# EAGLE design guider-shield (EAGLE 7.6.0)
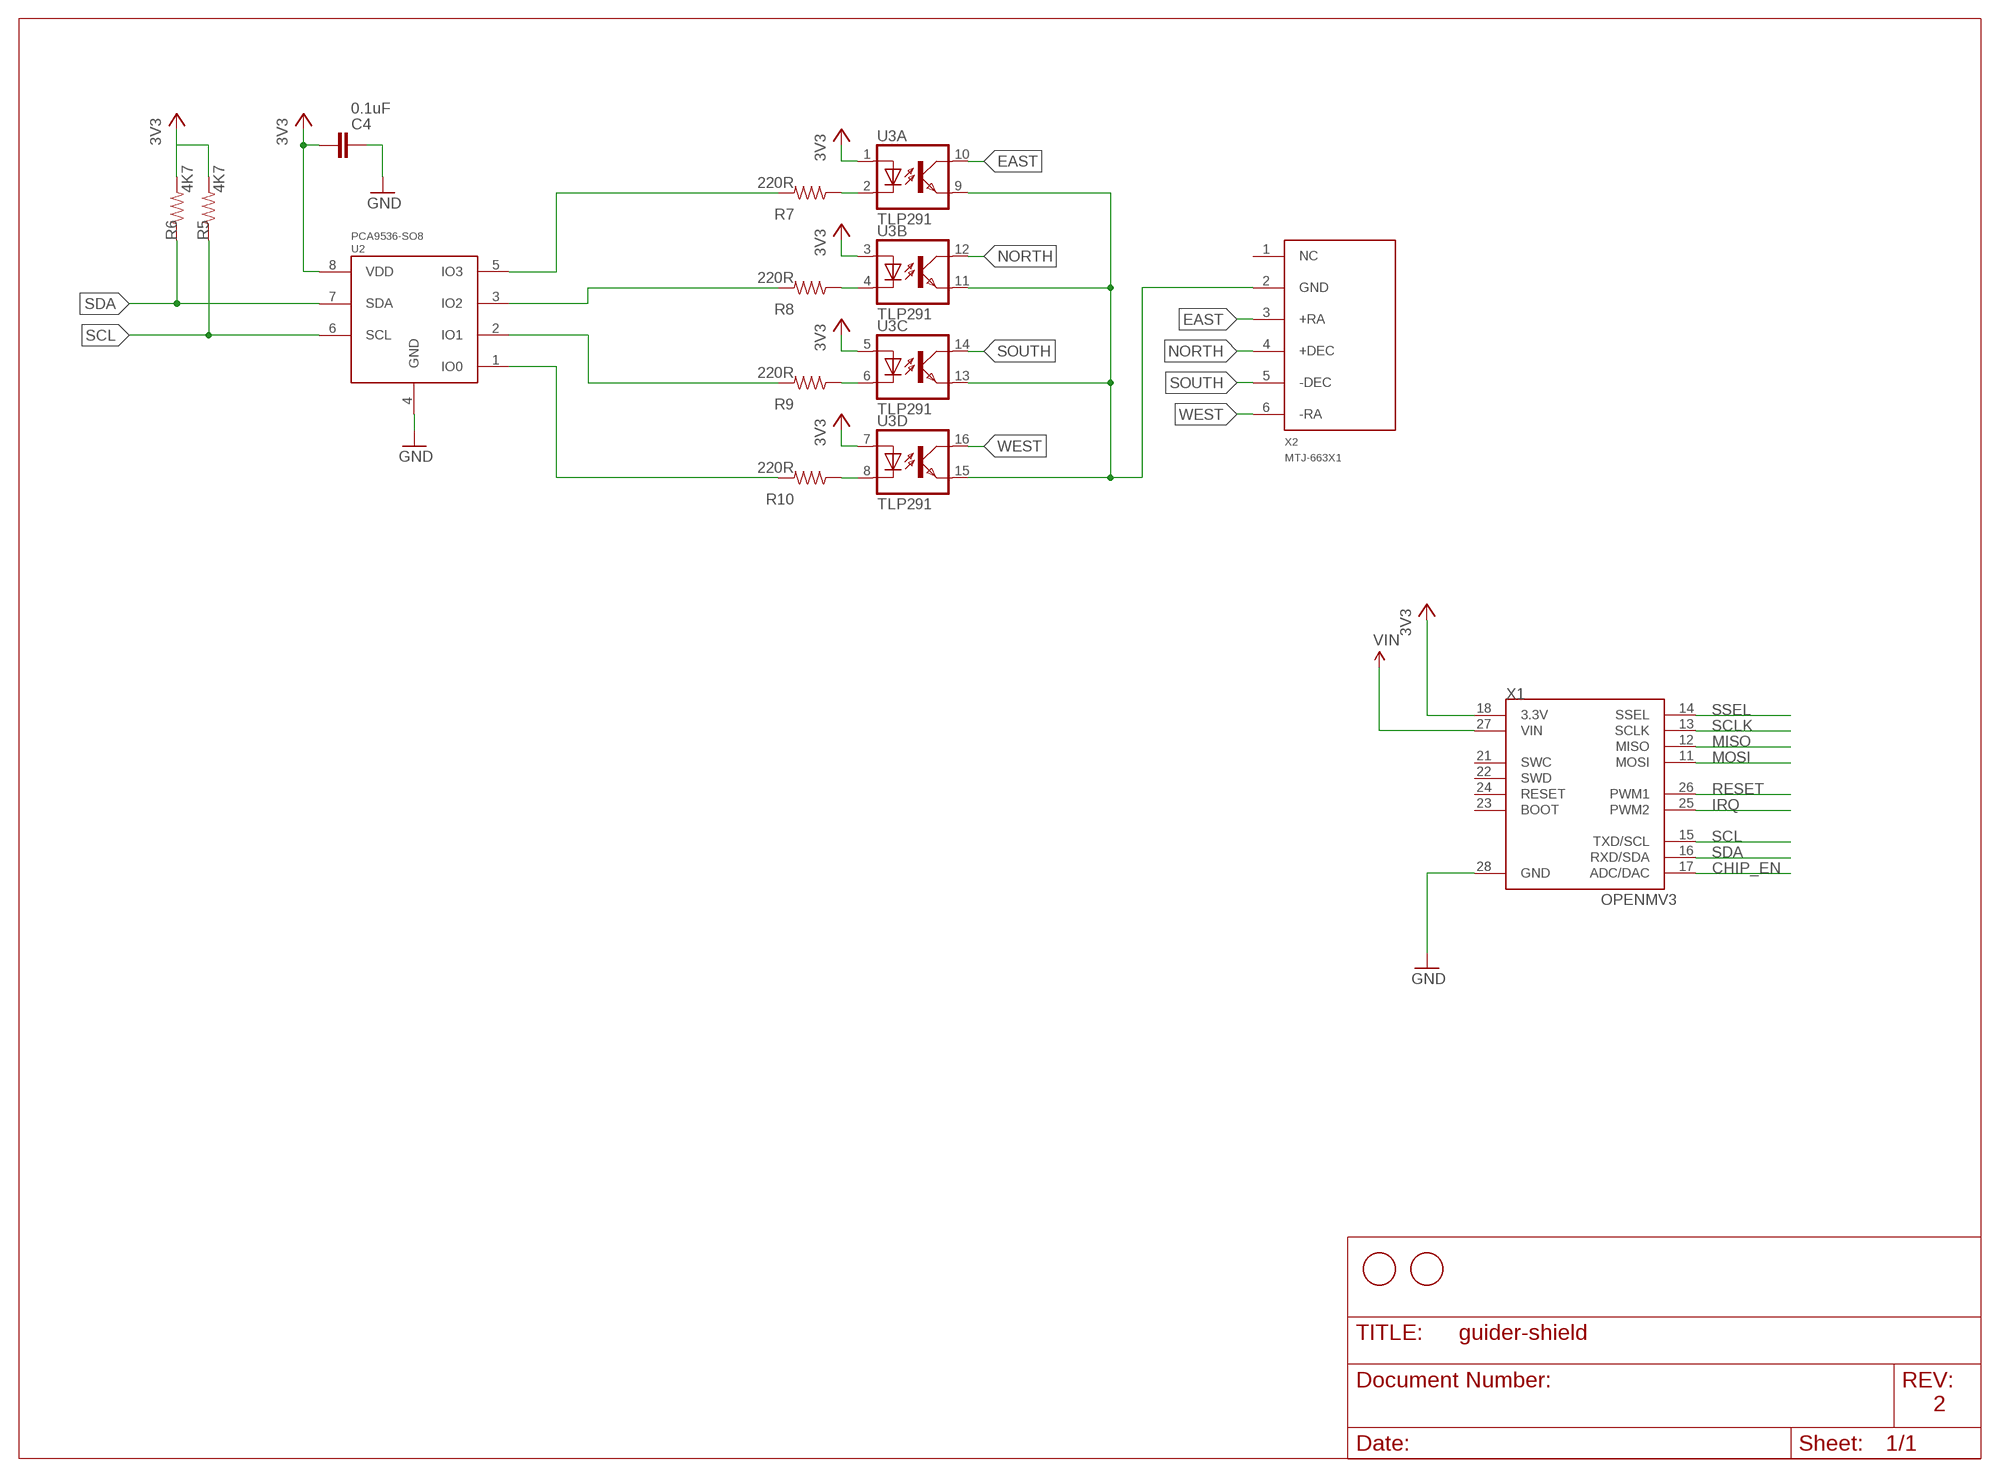
[diagram p0: schematic, sheet 1]

## Parts
C4  0.1uF  CAP0603-CAP  [0603-CAP]
R5  4K7  RESISTOR0603-RES  [0603-RES]
R6  4K7  RESISTOR0603-RES  [0603-RES]
R7  220R  RESISTOR0603-RES  [0603-RES]
R8  220R  RESISTOR0603-RES  [0603-RES]
R9  220R  RESISTOR0603-RES  [0603-RES]
R10  220R  RESISTOR0603-RES  [0603-RES]
U2  PCA9536-SO8  [SO08]
U3  TLP291  TLP283-4-SO016  [SO016]
U$1  FIDUCIAL  [FIDUCIAL_1MM]
U$2  FIDUCIAL  [FIDUCIAL_1MM]
X1  OPENMV3  [OPENMV3]
X2  MTJ-663X1  ST-4-MTJ-663X1  [MTJ-663X1]

## Nets
3V3: C4.1 R5.2 R6.2 U2.8(VDD) U3.1(A:A) U3.3(B:A) U3.5(C:A) U3.7(D:A) X1.18(3.3V)
CHIP_EN: X1.17(ADC/DAC)
EAST: U3.10(A:COL) X2.3(+RA)
GND: C4.2 U2.4(GND) X1.28(GND)
IRQ: X1.25(PWM2)
MISO: X1.12(MISO)
MOSI: X1.11(MOSI)
N$1: R7.2 U2.5(IO3)
N$2: R8.2 U2.3(IO2)
N$8: R7.1 U3.2(A:C)
N$16: R8.1 U3.4(B:C)
N$20: R9.1 U3.6(C:C)
N$21: R10.1 U3.8(D:C)
N$22: R9.2 U2.2(IO1)
N$23: R10.2 U2.1(IO0)
N$24: U3.9(A:EMIT) U3.11(B:EMIT) U3.13(C:EMIT) U3.15(D:EMIT) X2.2(GND)
NORTH: U3.12(B:COL) X2.4(+DEC)
RESET: X1.26(PWM1)
SCL: R5.1 U2.6(SCL) X1.15(TXD/SCL)
SCLK: X1.13(SCLK)
SDA: R6.1 U2.7(SDA) X1.16(RXD/SDA)
SOUTH: U3.14(C:COL) X2.5(-DEC)
SSEL: X1.14(SSEL)
VIN: X1.27(VIN)
WEST: U3.16(D:COL) X2.6(-RA)
Unconnected: X1.21(SWC) X1.22(SWD) X1.23(BOOT) X1.24(RESET) X2.1(NC)

## Notes on the sheet
- 2

## Library data of the parts
C4 = sfe:CAP: Capacitor Standard 0603 ceramic capacitor, and 0.1" leaded capacitor.
R5-R10 = sfe:RESISTOR: Resistor Basic schematic elements and footprints for 0603, 1206, and PTH resistors.
U2 = guider-shield:PCA9536
U3 = guider-shield:TLP283-4: TOSHIBA PHOTOCOUPLER GaAs IRED & PHOTO-TRANSISTOR Source: http://www.semicon.toshiba.co.jp/td/en/Opto/Photocoupler/en_20050928_TLP283_datasheet.pdf
U$1 U$2 = adafruit:FIDUCIAL: For use by pick and place machines to calibrate the vision/machine, 1mm By microbuilder.eu
X1 = openmv:OPENMV3
X2 = guider-shield:ST-4

## Net classes
1 vcc: width 1.016 mm, clearance 0.203 mm
2 antenna: width 0.363 mm, clearance 0.305 mm
3 1.8v: width 0.457 mm, clearance 0.254 mm

## Board
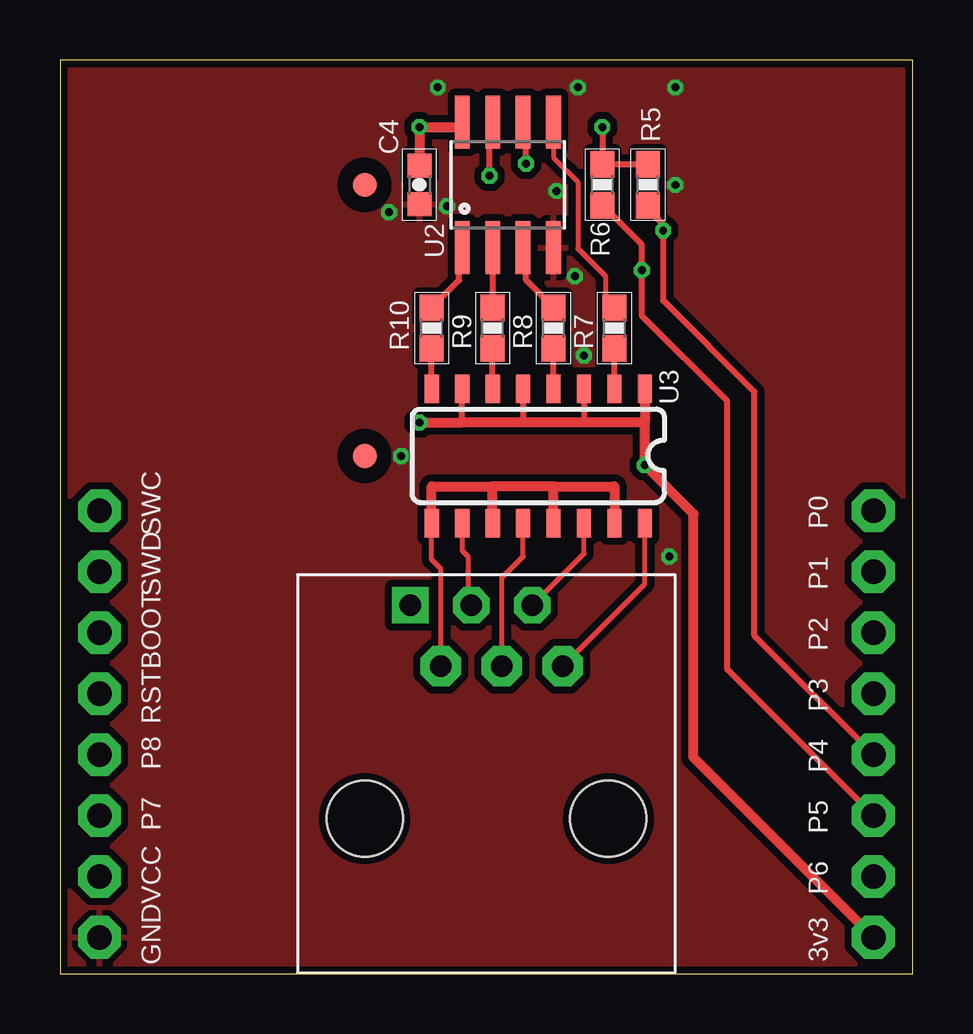
[diagram p1: board, top side]
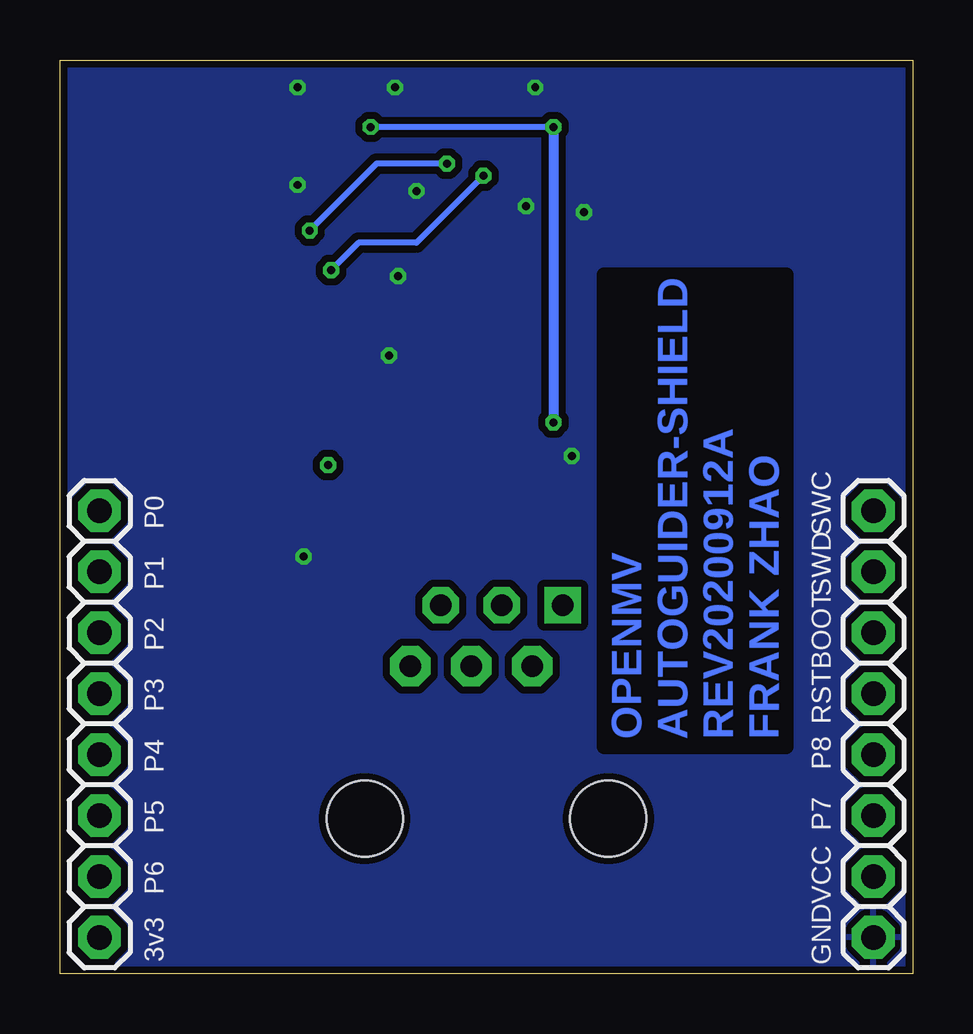
[diagram p2: board, bottom side, seen from below]

Size 35.56 x 38.1 mm. Coordinates in mm from the lower left corner, seen from the top.
Outline: 0,0 35.56,0 35.56,38.1 0,38.1 0,0
Copper layers (1*16): Top 0.035mm / dielectric 1.5mm / Bottom 0.035mm
Design rules "default": minimum track width 8mil, minimum drill 13mil, track to track 6mil, track to pad 6mil, pad to pad 6mil, via to via 6mil, smd to smd 6mil, copper to edge 5mil, drill to drill 10mil, minimum pad ring 10mil, minimum via ring 4mil, stop-mask expansion 2mil, vias tented up to drill 40mil, thermal gap 10mil

### Footprints (pad centres in the part's own frame; a part is rotated, then mirrored left to right if it is on the bottom)
0603-CAP = smd 1 x 1: 1 -0.8,0; 2 0.8,0
0603-RES = smd 1.1 x 1: 1 -0.85,0; 2 0.85,0
SO08 = smd 0.61 x 2.21: 1 -1.905,-2.616; 2 -0.635,-2.616; 3 0.635,-2.616; 4 1.905,-2.616; 5 1.905,2.616; 6 0.635,2.616; 7 -0.635,2.616; 8 -1.905,2.616
SO016 = smd 0.6 x 1.2: 1 -4.445,-2.8; 2 -3.175,-2.8; 3 -1.905,-2.8; 4 -0.635,-2.8; 5 0.635,-2.8; 6 1.905,-2.8; 7 3.175,-2.8; 8 4.445,-2.8; 9 4.445,2.8; 10 3.175,2.8; 11 1.905,2.8; 12 0.635,2.8; 13 -0.635,2.8; 14 -1.905,2.8; 15 -3.175,2.8; 16 -4.445,2.8
FIDUCIAL_1MM = smd 1 x 1: 1 0,0
OPENMV3 = drill 1.016 pad 1.778 octagon: 11 1.651,19.304; 12 1.651,16.764; 13 1.651,14.224; 14 1.651,11.684; 15 1.651,9.144; 16 1.651,6.604; 17 1.651,4.064; 18 1.651,1.524; 21 33.909,19.304; 22 33.909,16.764; 23 33.909,14.224; 24 33.909,11.684; 25 33.909,9.144; 26 33.909,6.604; 27 33.909,4.064; 28 33.909,1.524
MTJ-663X1 = drill 0.889 pad 1.524 square: 1 -3.175,8.89 | drill 0.889 pad 1.676 octagon: 2 -1.905,6.35; 4 0.635,6.35; 6 3.175,6.35 | drill 0.889 pad 1.524 octagon: 3 -0.635,8.89; 5 1.905,8.89 | hole 3.175: -5.08,0; 5.08,0

### Placement (x,y rotation side)
C4  14.99,32.89 270 top
R5  24.51,32.89 90 top
R6  22.61,32.89 90 top
R7  23.11,26.92 90 top
R8  20.57,26.92 90 top
R9  18.03,26.92 90 top
R10  15.49,26.92 90 top
U2  18.67,32.89 0 top
U3  19.94,21.59 180 top
U$1  12.7,21.59 0 top
U$2  12.7,32.89 0 top
U$3  [LOGO]  5.59,9.78 90 bottom
X1  35.56,0 0 bottom
X2  17.78,6.48 0 top

### Tracks (layer width: path | path; a pad name or v marks a point on that pad's centre or on a via)
3V3  (via drill 0.33)
  Top 0.254: 16.76,22.99 U3.7 | U3.5 19.3,22.99 | U3.3 21.84,22.99 | R5.2 R6.2 v22.61,35.31
  Top 0.406: U3.1 24.38,22.99 | 24.38,22.99 21.84,22.99 19.3,22.99 16.76,22.99 v14.99,22.99 | 24.38,22.99 v24.38,21.21 26.42,19.18 26.42,9.02 X1.18 | U2.8 16.76,35.31 v14.99,35.31 C4.1
  Bottom 0.254: v14.99,35.31 v22.61,35.31
  Bottom 0.406: v14.99,35.31 v14.99,22.99
EAST
  Top 0.203: U3.10 16.76,17.65 17.02,17.4 17.02,15.49 X2.3
GND  (via drill 0.33)
  other vias: 21.84,25.78 21.46,29.08 16.13,32 13.72,31.75 25.65,32.89 21.59,36.96 25.65,36.96 14.22,21.59 15.75,36.96 20.7,32.64 25.4,17.4
  pour Top (isolate 0.305, rank 2): 0,0 0,38.1 35.56,38.1 35.56,0
  pour Bottom (isolate 0.305, rank 2): 0,0 0,38.1 35.56,38.1 35.56,0
N$1
  Top 0.203: U2.5 20.57,34.04 21.59,33.02 21.59,30.23 22.73,29.08 22.73,28.16 R7.2
N$2
  Top 0.254: R8.2 19.43,28.92 19.43,30.28 U2.3
N$8
  Top 0.254: U3.2 R7.1
N$16
  Top 0.254: U3.4 R8.1
N$20
  Top 0.254: U3.6 R9.1
N$21
  Top 0.254: U3.8 R10.1
N$22
  Top 0.254: U2.2 R9.2
N$23
  Top 0.254: R10.2 16.64,28.92 16.64,30.28 U2.1
N$24
  Top 0.203: X2.2 15.88,16.89 15.49,17.27 U3.9
  Top 0.406: U3.9 15.49,20.32 18.03,20.32 | 20.57,20.32 23.11,20.32 U3.15 | U3.13 20.57,20.32 | 20.57,20.32 18.03,20.32 | U3.11 18.03,20.32
NORTH
  Top 0.203: 19.3,18.41 U3.12 19.3,17.4 18.41,16.51 X2.4
SCL  (via drill 0.33)
  Top 0.254: v19.43,33.78 19.43,35.51 U2.6 | R5.1 24.51,31.88 25.15,31.24 v25.15,30.99 25.15,28.07 28.96,24.26 28.96,14.1 X1.15
  Bottom 0.254: v19.43,33.78 22.35,33.78 v25.15,30.99
SDA  (via drill 0.33)
  Top 0.254: R6.1 24.26,30.39 v24.26,29.34 24.26,27.43 27.81,23.88 27.81,12.7 X1.16 | v17.91,33.27 17.91,35.51 U2.7
  Bottom 0.254: v17.91,33.27 20.7,30.48 23.11,30.48 v24.26,29.34
SOUTH
  Top 0.203: X2.5 21.84,17.53 U3.14
WEST
  Top 0.203: X2.6 24.38,16.26 U3.16

### Text on the board
tPlace: P0 | SWC | SWD | P1 | BOOT | P2 | P3 | RST | P8 | P4 | P7 | P5 | VCC | P6 | 3v3 | GND
bPlace: P0 | SWC | SWD | P1 | BOOT | P2 | P3 | RST | P8 | P4 | P7 | P5 | VCC | P6 | 3v3 | GND